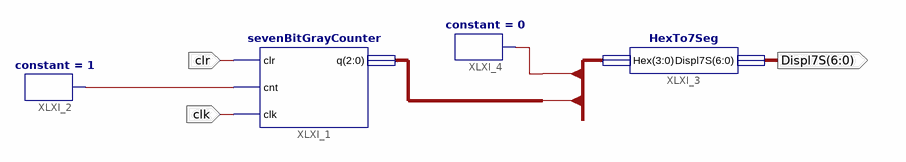
[diagram p0: schematic sheet 1]
// Xilinx ISE schematic schematGraya.sch (aspartan6) as structural Verilog: 4 symbols, 3 ports
module schematGraya (
  input  clr,
  input  clk,
  output [6:0] Displ7S
);

  wire cnt;
  wire [3:0] Hex;

  sevenBitGrayCounter XLXI_1 (.clr(clr), .cnt(cnt), .clk(clk), .q(Hex[2:0]));
  constant #(.CValue("1")) XLXI_2 (.O(cnt));
  HexTo7Seg XLXI_3 (.Hex(Hex), .Displ7S(Displ7S));
  constant #(.CValue("0")) XLXI_4 (.O(Hex[3]));
endmodule
